# EAGLE design BUCK5 (EAGLE 9.6.2)
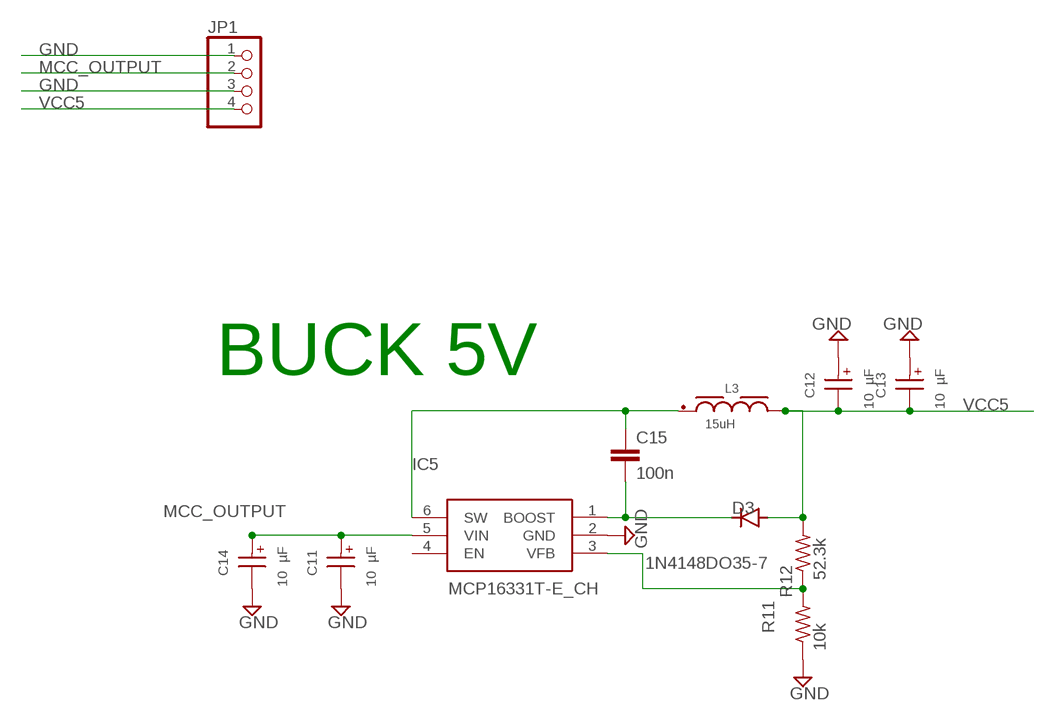
[diagram p0: schematic, sheet 1]

## Parts
C11  10 µF  WCAP-ASLI_6.3X7.7_865080845005  [WCAP-ASLI_6.3X7.7(DXL)]
C12  10 µF  WCAP-ASLI_6.3X7.7_865080845005  [WCAP-ASLI_6.3X7.7(DXL)]
C13  10 µF  WCAP-ASLI_6.3X7.7_865080845005  [WCAP-ASLI_6.3X7.7(DXL)]
C14  10 µF  WCAP-ASLI_6.3X7.7_865080845005  [WCAP-ASLI_6.3X7.7(DXL)]
C15  100n  C-EUC0805  [C0805]
D3  1N4148DO35-7  [DO35-7]
IC5  MCP16331T-E_CH  [SOT95P280X145-6N]
JP1  PINHD-1X4  [1X04]
L3  15uH  WE-PD_7345R_7447779115  [WE-PD_7345R]
R11  10k  R-US_R0603  [R0603]
R12  52.3k  R-US_R0603  [R0603]

## Nets
GND: C11.2(-) C12.1(+) C13.1(+) C14.2(-) IC5.2(GND) JP1.1 JP1.3 R11.1
MCC_OUTPUT: C11.1(+) C14.1(+) IC5.5(VIN) JP1.2
N$17: C15.1 IC5.6(SW) L3.1
N$21: C15.2 D3.C IC5.1(BOOST)
N$22: IC5.3(VFB) R11.2 R12.1
VCC5: C12.2(-) C13.2(-) D3.A JP1.4 L3.2 R12.2
Unconnected: IC5.4(EN)

## Notes on the sheet
- BUCK 5V

## Library data of the parts
C11-C14 = Eagle_WCAP-ASLI (rev20a):WCAP-ASLI_6.3X7.7: WCAP-ASLI Aluminium Electrolytic Capacitors Low Impedance +105 °C Characteristics Low impedance product series Mounting style: V-Chip SMT Capacitance range: 0.1 µF ‒ 6800 µF Capacitance tolerance: ±20 % Voltage range (UR): 6.3 ‒ 100 V(DC) Operating temperature: -55 °C up to +105 °C Endurance: 2000 h @ +105 °C Dimensions (DxL) in mm: 4.0 x 5.5 up to 16.0 x 17.0 Recommended soldering: Reflow soldering Applications Low impedance, especially for filtering applications Input and output capacitor for switched-mode power supply Filtering Smoothing e.g. DC/DC converter, AC/DC converter, satellite receiver, control panel <https://www.we-online.com/catalog/media/o14723v209%20Family_WCAP-ASLI.jpg> Details see: https://www.we-online.com/catalog/en/WCAP-ASLI/ Updated by yingchun,Shan;2020-03-03 2020(C) Würth Elektronik; DATASHEET-URL: https://www.we-online.com/catalog/datasheet/865080845005.pdf; DF: 10%; DIAMETER: 6.3mm; I-LEAK: 10uA; I-RIPPLE: 35mA; L: 7.7mm; OPERATING-TEMPERATURE: -55 °C up to +105 °C; PART-NUMBER: 865080845005; TECHNICAL-REFERENCE: ASED077100M100DVCTCB000; VR: 100V(DC)
C15 = rcl:C-EU: CAPACITOR, European symbol; SPICEPREFIX: C
D3 = diode:1N4148: DIODE high speed (Philips)
IC5 = MCP16331T-E_CH:MCP16331T-E_CH: 50V 500mA Adj. Switch Regulator SOT23-6 Microchip, MCP16331T-E/CH Step-Down Switching Regulator 1.2A Adjustable, 2 24 V, 6-Pin SOT-23 Source: Datasheet <http://ww1.microchip.com/downloads/en/DeviceDoc/20005308C.pdf>; ARROW_PART_NUMBER: MCP16331T-E/CH; ARROW_PRICE-STOCK: https://www.arrow.com/en/products/mcp16331t-ech/microchip-technology?region=nac; DESCRIPTION: 50V 500mA Adj. Switch Regulator SOT23-6 Microchip, MCP16331T-E/CH Step-Down Switching Regulator 1.2A Adjustable, 2 24 V, 6-Pin SOT-23; HEIGHT: 1.45mm; MANUFACTURER_NAME: Microchip; MANUFACTURER_PART_NUMBER: MCP16331T-E/CH; MOUSER_PART_NUMBER: 579-MCP16331T-E/CH; MOUSER_PRICE-STOCK: https://www.mouser.co.uk/ProductDetail/Microchip-Technology/MCP16331T-E-CH?qs=rQCxX1QmdjIpfF%2FjMAUv9A%3D%3D
JP1 = pinhead:PINHD-1X4: PIN HEADER
L3 = Eagle_WE-PD (rev20a)(1):WE-PD_7345R: WE-PD SMT Power Inductor Characteristics AECQ 200 Qualified Ultra low RDC and RAC Highest possible saturation current based on Ferrite Suitable for switching frequency up to 10MHz Temperature dependent parameter available on Redexpert Operating Temperature from -40°C to +125°C / +150°C Types WE-PD: Since always with low loss material, tight tolerances and high saturation behavior compared to other manufacturers in the market WE-PD Robust: Plastic base improves the mechanical stability and efficiency WE-PD Performance: MnZn core improves Saturation and RDC for highest efficiency Applications Switch Mode Power supplies from 0,1W up to 300W Integrated DC DC Converter Ideal for Switch Mode Power supplies with extreme high efficiency (>95%) <https://www.we-online.com/catalog/media/o14825v209%20Family_WE-PD.jpg> Details see: https://www.we-online.com/catalog/en/WE-PD/ Updated by Yingchun,Shan 2019-07-25 2019 (C) Wurth Elektronik; DATASHEET-URL: https://www.we-online.com/catalog/datasheet/7447779115.pdf; FRES: 19.5MHz; IR: 1.6A; ISAT: 2.2A; MOUNT: SMT; PART-NUMBER: 7447779115; RDC-MAX: 81mOhm; RDC-TYP: 70mOhm; VERSION: Robust
R11 R12 = rcl:R-US_: RESISTOR, American symbol; SPICEPREFIX: R

## Board
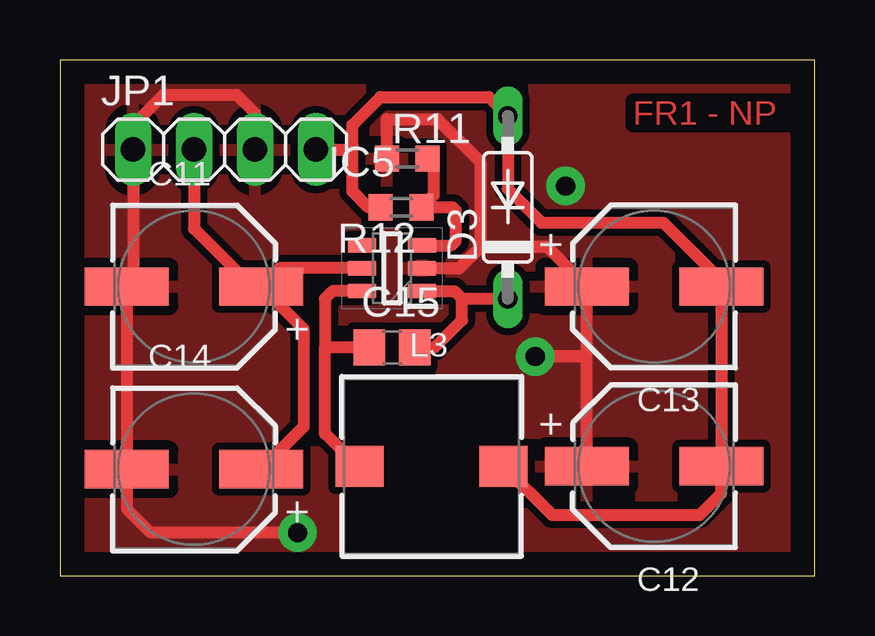
[diagram p1: board, top side]
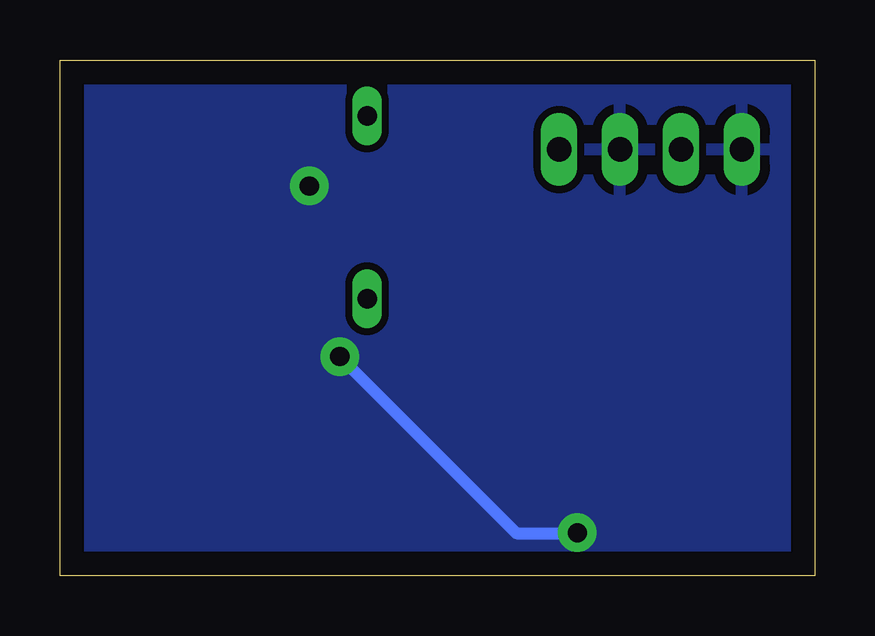
[diagram p2: board, bottom side, seen from below]

Size 31.48 x 21.51 mm. Coordinates in mm from the lower left corner, seen from the top.
Outline: 0,0 31.48,0 31.48,21.51 0,21.51 0,0
Copper layers (1*16): Top 0.035mm / dielectric 1.5mm / Bottom 0.035mm
Design rules "fixhregle *": minimum track width 0.2mm, minimum drill 0.6mm, track to track 0.3mm, track to pad 0.3mm, pad to pad 0.3mm, via to via 0.3mm, smd to smd 0.185mm, copper to edge 1mm, drill to drill 0.4mm, minimum pad ring 0.2mm, minimum via ring 0.2mm, stop-mask expansion 4mil, vias tented up to drill 0mil, thermal gap 0.4mm

### Footprints (pad centres in the part's own frame; a part is rotated, then mirrored left to right if it is on the bottom)
WCAP-ASLI_6.3X7.7(DXL) = smd 3.5 x 1.6: 1 2.8,0; 2 -2.8,0
C0805 = smd 1.3 x 1.5: 1 -0.95,0; 2 0.95,0
DO35-7 = drill 0.813 long: A 3.81,0; C -3.81,0
SOT95P280X145-6N = smd 1.15 x 0.6: 1 -1.25,0.95; 2 -1.25,0; 3 -1.25,-0.95; 4 1.25,-0.95; 5 1.25,0; 6 1.25,0.95
1X04 = drill 1.016 long: 1 -3.81,0; 2 -1.27,0; 3 1.27,0; 4 3.81,0
WE-PD_7345R = smd 2 x 1.7: 1 -3,0; 2 3,0
R0603 = smd 1 x 1.1: 1 -0.85,0; 2 0.85,0

### Placement (x,y rotation side)
C11  5.59,12.06 0 top
C12  24.77,4.57 180 top
C13  24.77,12.06 180 top
C14  5.59,4.45 0 top
C15  13.84,9.53 0 top
D3  18.67,15.37 90 top
IC5  13.84,12.83 180 top
JP1  6.86,17.78 0 top
L3  15.49,4.57 0 top
R11  14.48,17.4 0 top
R12  14.22,15.37 180 top

### Tracks (layer width: path | path; a pad name or v marks a point on that pad's centre or on a via)
GND  (via drill 0.8 pad 1.6)
  Top 0.508: R11.1 13.63,19.05 15.75,19.05 17.53,17.27 17.53,13.72 | IC5.2 16.64,12.83 17.53,13.72 | JP1.3 8.13,19.3 7.37,20.07 4.32,20.07 3.05,18.8 JP1.1 3.04,12.32 C11.2 C14.2 2.79,2.8 3.79,1.8 v9.91,1.8 | C12.1 21.96,9.14 | 21.96,9.14 C13.1 20.31,13.72 17.53,13.72 | 21.96,9.14 v19.81,9.14
  Bottom 0.508: v19.81,9.14 12.45,1.78 9.91,1.78 v9.91,1.8
  other vias: 21.08,16.26
  pour Top: 0,0 0,21.59 31.5,21.59 31.5,0
  pour Bottom: 0,0 0,21.59 31.5,21.59 31.5,0
MCC_OUTPUT
  Top 0.508: C11.1 10.17,10.29 10.17,6.22 C14.1 | IC5.5 9.15,12.83 C11.1 | JP1.2 5.59,14.48 8,12.06 C11.1
N$17
  Top 0.508: C15.1 11.05,9.53 | L3.1 11.9,5.17 11.82,5.17 11.05,5.94 11.05,9.53 | IC5.6 11.37,11.88 11.05,11.56 11.05,9.53
N$21
  Top 0.508: 16.76,11.56 D3.C | IC5.1 16.44,11.88 16.76,11.56 | C15.2 15.62,9.53 16.76,10.67 16.76,11.56
N$22
  Top 0.508: R11.2 15.58,17.14 15.58,15.88 R12.1 16.38,15.37 16.51,15.24 16.51,13.97 16.32,13.78 IC5.3
VCC5
  Top 0.508: R12.2 12.87,15.37 12.19,16.04 12.19,17.78 | 12.19,17.78 12.19,18.8 13.36,19.96 17.88,19.96 D3.A 18.67,16.13 20.07,14.73 25.15,14.73 27.57,12.31 C13.2 C12.2 27.57,3.44 26.67,2.54 20.53,2.54 L3.2 | JP1.4 12.19,17.78

### Text on the board
Top: FR1 - NP